# EAGLE schematic motor_driver_breakout (EAGLE 9.5.1)
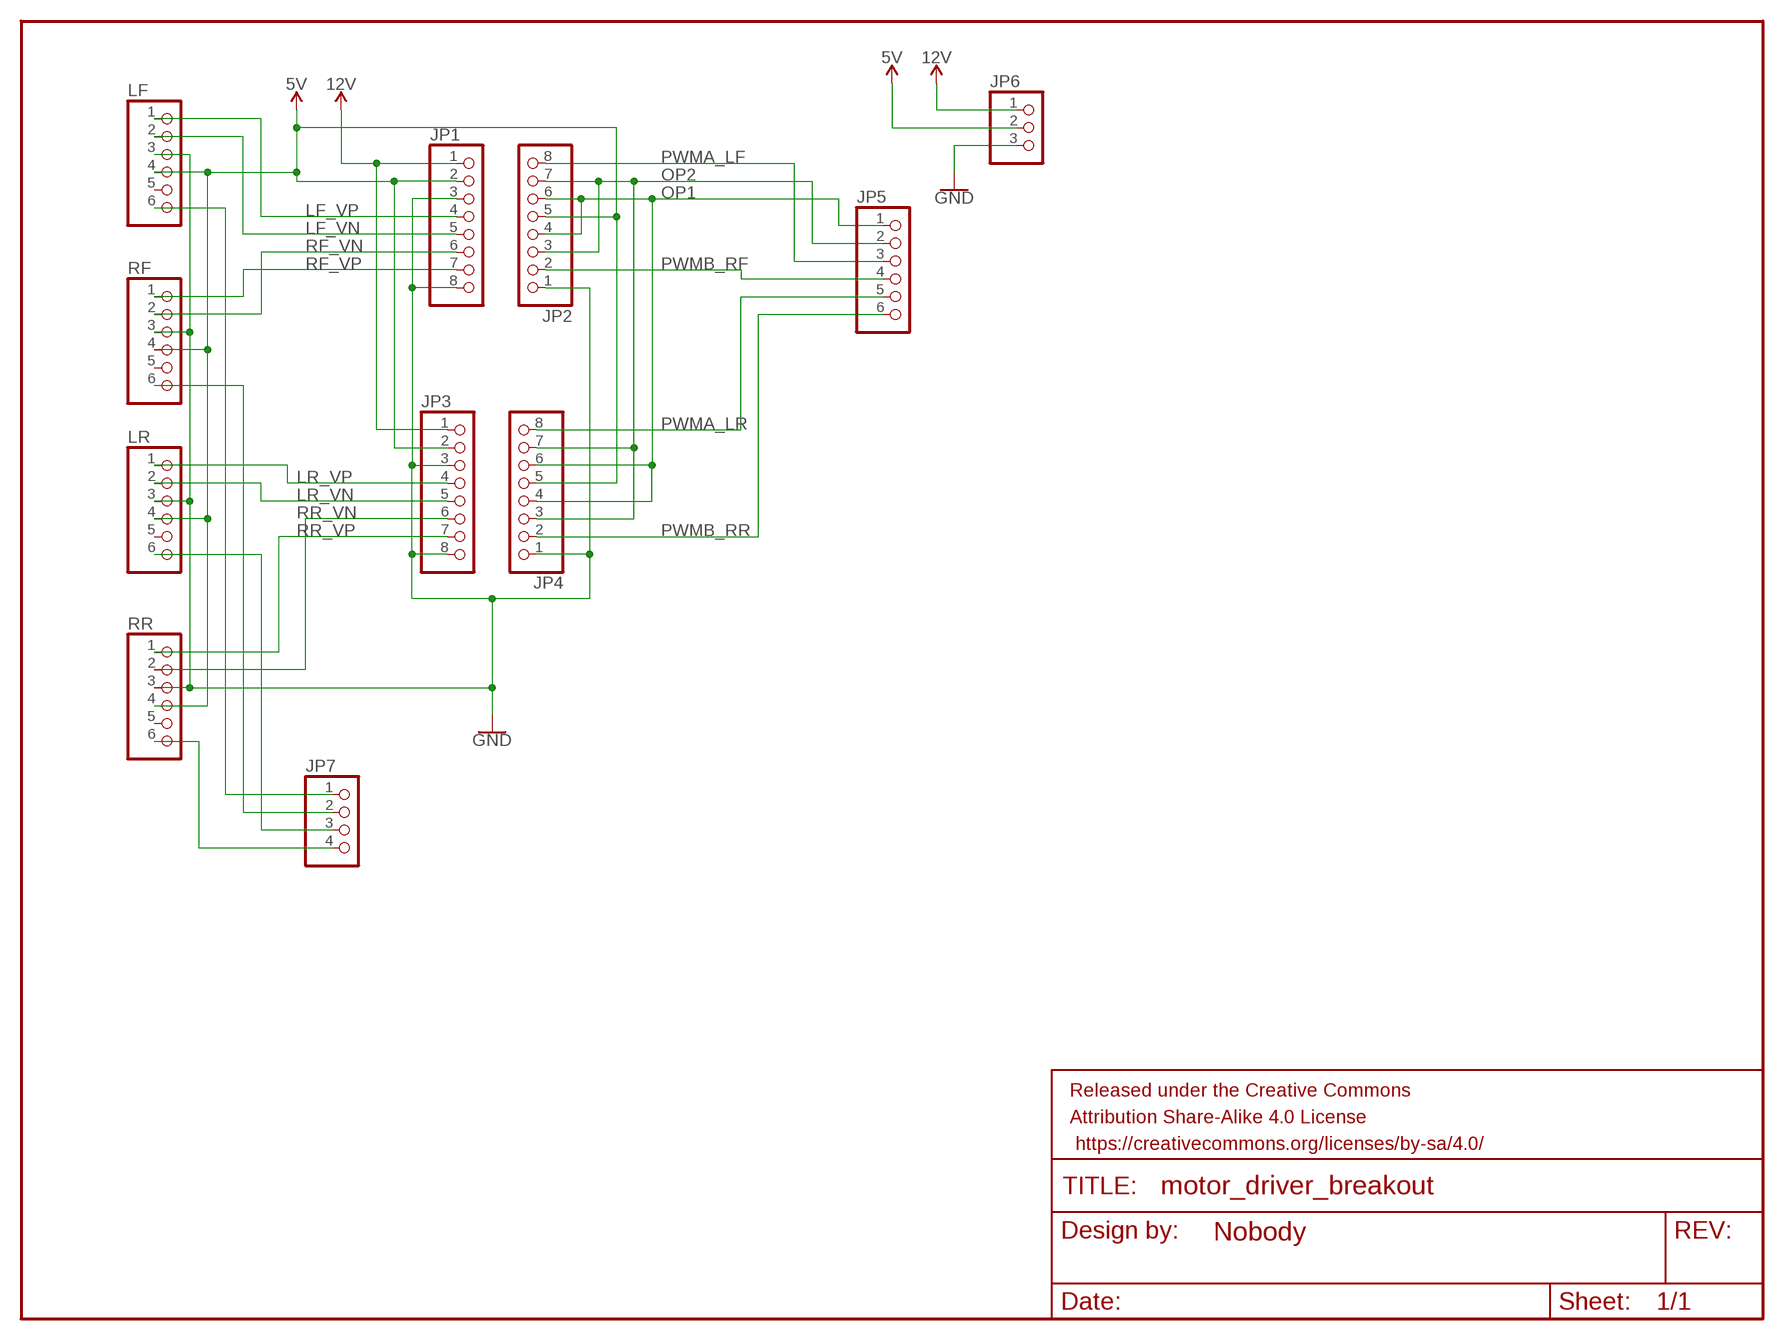
[diagram p0: schematic, sheet 1]

## Parts
FRAME1  FRAME-LETTERNO_PACKAGE  [DUMMY]
JP1  PINHD-1X8  [1X08]
JP2  PINHD-1X8  [1X08]
JP3  PINHD-1X8  [1X08]
JP4  PINHD-1X8  [1X08]
JP5  PINHD-1X6  [1X06]
JP6  PINHD-1X3  [1X03]
JP7  PINHD-1X4  [1X04]
LF  PINHD-1X6  [1X06]
LR  PINHD-1X6  [1X06]
RF  PINHD-1X6  [1X06]
RR  PINHD-1X6  [1X06]

## Nets
5V: JP1.2 JP2.5 JP3.2 JP4.5 JP6.2 LF.4 LR.4 RF.4 RR.4
12V: JP1.1 JP3.1 JP6.1
GND: JP1.3 JP1.8 JP2.1 JP3.3 JP3.8 JP4.1 JP6.3 LF.3 LR.3 RF.3 RR.3
LF_VN: JP1.5 LF.2
LF_VP: JP1.4 LF.1
LR_VN: JP3.5 LR.2
LR_VP: JP3.4 LR.1
N$1: JP7.1 LF.6
N$2: JP7.2 RF.6
N$3: JP7.3 LR.6
N$4: JP7.4 RR.6
OP1: JP2.4 JP2.6 JP4.4 JP4.6 JP5.1
OP2: JP2.3 JP2.7 JP4.3 JP4.7 JP5.2
PWMA_LF: JP2.8 JP5.3
PWMA_LR: JP4.8 JP5.5
PWMB_RF: JP2.2 JP5.4
PWMB_RR: JP4.2 JP5.6
RF_VN: JP1.6 RF.2
RF_VP: JP1.7 RF.1
RR_VN: JP3.6 RR.2
RR_VP: JP3.7 RR.1
Unconnected: LF.5 LR.5 RF.5 RR.5

## Library data of the parts
FRAME1 = SparkFun-Aesthetics:FRAME-LETTER: Schematic Frame - Letter Standard 8.5x11 US Letter frame; DESIGNER: Nobody; VERSION: v01
JP1-JP4 = pinhead:PINHD-1X8: PIN HEADER
JP5 LF LR RF RR = pinhead:PINHD-1X6: PIN HEADER
JP6 = pinhead:PINHD-1X3: PIN HEADER
JP7 = pinhead:PINHD-1X4: PIN HEADER